# Altium schematic sheet 2_电源.schdoc
size 431 x 309 mm; Symbol: Sheet-Symbol_A3; Device: Sheet-Symbol_A3; Company: 嘉立创EDA; Version: V1.0; Page Size: A3; @Project Name: 辉光管时钟V2.0; @Page Count: 2; @Update Date: 2024-09-19; @Create Date: 2024-09-08; @Schematic Name: 电源+控制部分; @Page No: 2; @Page Name: 电源; @Board Name: 电源+控制部分; @Create Time: 15:46:08; @Update Time: 21:44:50
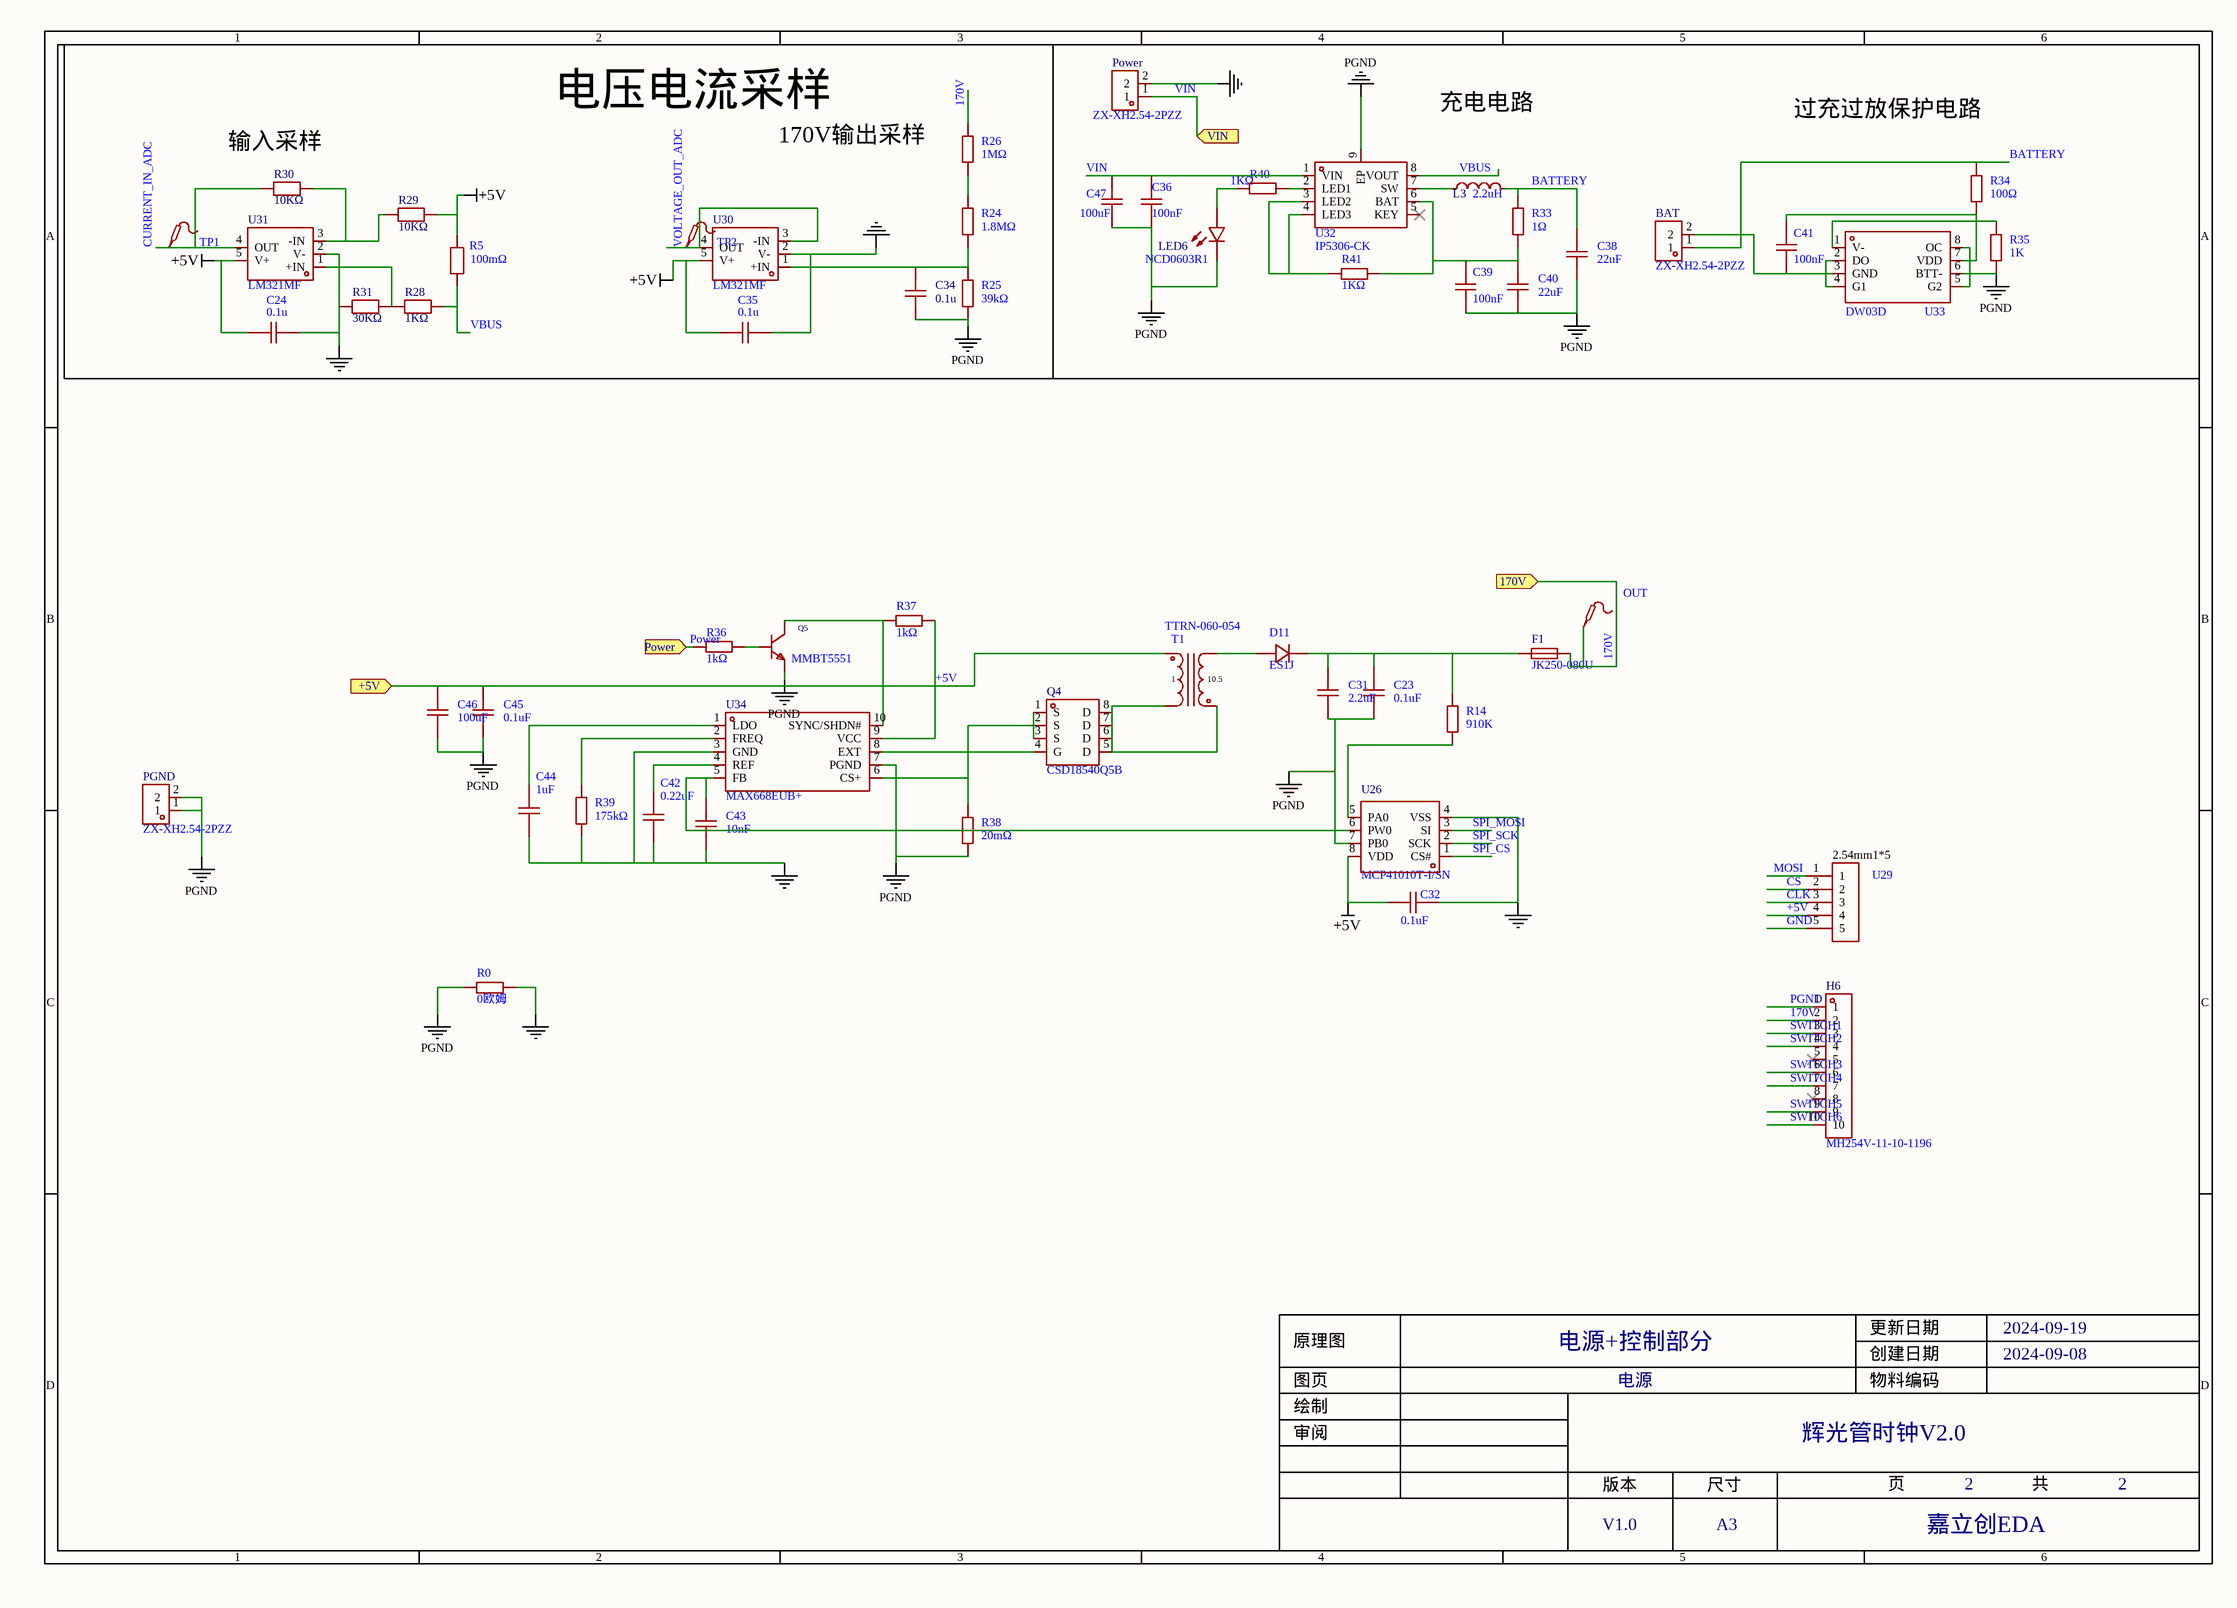
[diagram p0: 2_电源.schdoc]

## Parts
BAT  ZX-XH2.54-2PZZ  [CONN-TH_2P-P2.50_HX25003-2A]
C23  0.1uF  [c1206]
C24  0.1u  [C0603]
C31  2.2uF  [c1210]
C32  0.1uF  [c0603]
C34  0.1u  [C0603]
C35  0.1u  [C0603]
C36  100nF  [C0603]
C38  22uF  [c1206]
C39  100nF  [C0603]
C40  22uF  [c1206]
C41  100nF  [C0603]
C42  0.22uF  [c0603]
C43  10nF  [c0603]
C44  1uF  [c0603]
C45  0.1uF  [c0603]
C46  100uF  [c1206]
C47  100uF  [c1206]
D11  ES1J  [sod-123_l2.7-w1.6-ls3.6-rd]
F1  JK250-080U  [FUSE-TH_L5.8-W3.8-P5.10-D0.8]
H6  MH254V-11-10-1196  [HDR-TH_10P-P2.54-V-M]
L3  2.2uH  [IND-SMD_L7.0-W6.6]
LED6  NCD0603R1  [LED0603-RD_RED]
OUT  (no value)  [Test-Point-0.5mm]
PGND  ZX-XH2.54-2PZZ  [CONN-TH_2P-P2.50_HX25003-2A]
Power  ZX-XH2.54-2PZZ  [CONN-TH_2P-P2.50_HX25003-2A]
Q4  CSD18540Q5B  [VSON-CLIP-8_L5.0-W6.0-P1.27-BL]
Q5  MMBT5551  [SOT-23-3_L2.9-W1.3-P1.90-LS2.4-BR]
R0  0欧姆  [R0603]
R5  100mΩ  [R0805]
R14  910K  [r0603]
R24  1.8MΩ  [r0603]
R25  39kΩ  [r0603]
R26  1MΩ  [r0603]
R28  1KΩ  [R0603]
R29  10KΩ  [R0603]
R30  10KΩ  [R0603]
R31  30KΩ  [R0603]
R33  1Ω  [R0603]
R34  100Ω  [R0603]
R35  1K  [R0603]
R36  1kΩ  [r0603]
R37  1kΩ  [r0603]
R38  20mΩ  [R0805]
R39  175kΩ  [r0603]
R40  1KΩ  [R0603]
R41  1KΩ  [R0603]
T1  TTRN-060-054  [TTRN-060-054]
TP1  (no value)  [Test-Point-0.5mm]
TP2  (no value)  [Test-Point-0.5mm]
U26  MCP41010T-I/SN  [SOIC-8_L4.9-W3.9-P1.27-LS6.0-BL]
U29  (no value)  [2.54mm1*5]
U30  LM321MF  [SOT-23-5_L2.9-W1.6-P0.95-LS2.8-BL]
U31  LM321MF  [SOT-23-5_L2.9-W1.6-P0.95-LS2.8-BL]
U32  IP5306-CK  [SOP-8_L4.9-W3.9-P1.27-LS6.0-BL-EP2.1]
U33  DW03D  [TSSOP-8_L4.4-W3.0-P0.65-LS6.4-BL]
U34  MAX668EUB+  [UMAX-10_L3.0-W3.0-P0.50-LS4.9-BL]

## Blocks framed on the sheet
电压电流采样: C24 C34 C35 R5 R24-R26 R28-R31 TP1 TP2 U30 U31

## Ports
170V (in), +5V (in), Power (in), VIN (in)

## Nets
+5V: C24.2 C32.2 C35.2 C45.2 C46.2 R5.2 R29.1 R37.2 T1.1 U26.8(VDD) U29.4 U30.5(V+) U31.5(V+) U34.9(VCC) ; port +5V
GND: C24.1 C32.1 C35.1 C42.1 C43.1 C44.1 R0.2 R31.1 R39.2 U26.4(VSS) U29.5 U30.2(V-) U31.2(V-) U34.3(GND)
PGND: C23.1 C31.1 C34.2 C36.1 C38.1 C39.1 C40.1 C45.1 C46.1 C47.1 H6.1 LED6.1(K) PGND.1 PGND.2 Power.2 Q5.2(E) R0.1 R25.1 R35.1 R38.1 U26.7(PB0) U32.9(EP) U33.6(BTT-) U34.7(PGND)
170V: F1.2 H6.2 OUT.1 R26.2 ; port 170V
BATTERY: BAT.1 C38.2 L3.2 R33.2 R34.2
CLK: U29.3
CS: U29.2
CURRENT_IN_ADC: R30.2 TP1.1 U31.4(OUT)
MOSI: U29.1
Power: R36.2 ; port Power
SPI_CS: U26.1(CS#)
SPI_MOSI: U26.3(SI)
SPI_SCK: U26.2(SCK)
SWITCH1: H6.3
SWITCH2: H6.4
SWITCH3: H6.6
SWITCH4: H6.7
SWITCH5: H6.9
SWITCH6: H6.10
VBUS: R5.1 R28.1 U32.8(VOUT)
VIN: C36.2 C47.2 Power.1 U32.1(VIN) ; port VIN
VOLTAGE_OUT_ADC: TP2.1 U30.3(-IN) U30.4(OUT)
NetBAT_2: BAT.2 C41.1 U33.3(GND)
NetC23_2: C23.2 C31.2 D11.1(K) F1.1 R14.2
NetC34_1: C34.1 R24.1 R25.2 U30.1(+IN)
NetC39_2: C39.2 C40.2 R33.1 R41.1 U32.6(BAT)
NetC41_2: C41.2 R34.1 U33.7(VDD)
NetC42_2: C42.2 U34.4(REF)
NetC43_2: C43.2 U26.6(PW0) U34.5(FB)
NetC44_2: C44.2 U34.1(LDO)
NetD11_2: D11.2(A) T1.3
NetL3_1: L3.1 U32.7(SW)
NetLED6_2: LED6.2(A) R40.2
NetQ4_1: Q4.1(S) Q4.2(S) Q4.3(S) R38.2 U34.6(CS+)
NetQ4_4: Q4.4(G) U34.8(EXT)
NetQ4_5: Q4.5(D) Q4.6(D) Q4.7(D) Q4.8(D) T1.2 T1.4
NetQ5_1: Q5.1(B) R36.1
NetQ5_3: Q5.3(C) R37.1 U34.10(SYNC/SHDN#)
NetR14_1: R14.1 U26.5(PA0)
NetR24_2: R24.2 R26.1
NetR28_2: R28.2 R31.2 U31.1(+IN)
NetR29_2: R29.2 R30.1 U31.3(-IN)
NetR35_2: R35.2 U33.1(V-)
NetR39_1: R39.1 U34.2(FREQ)
NetR40_1: R40.1 U32.2(LED1)
NetR41_2: R41.2 U32.3(LED2) U32.4(LED3)
NetU33_2: U33.2(DO) U33.4(G1)
NetU33_5: U33.5(G2) U33.8(OC)

Not connected (* = marked no-connect by the designer): H6 5* 8*; U32 5(KEY)*

## Notes on the sheet
- 充电电路
- 过充过放保护电路
- (near R30) 输入采样
- 170V输出采样
- 1
- 2
- 3
- 4
- 5
- 6
- A
- B
- C
- 原理图
- 电源+控制部分
- 创建日期
- 更新日期
- 2024-09-19
- 2024-09-08
- D
- 审阅
- 绘制
- 图页
- 电源
- 物料编码
- 辉光管时钟V2.0
- 版本
- 尺寸
- 页
- 共
- V1.0
- A3
- 嘉立创EDA
- (in symbol TTRN-060-054) 10.5

## Library data of the parts
BAT PGND Power = ZX-XH2.54-2PZZ: Manufacturer: Megastar(兆星); Add into BOM: yes; Pins Structure: 1x2P; Pitch: 2.54mm; Reference Series: XH; Number of PINs Per Row: 2; Current Rating (Max): 3A; Symbol: ZX-XH2.54-2PZZ; Device: ZX-XH2.54-2PZZ; Supplier: LCSC; Supplier Part: C7429632; Manufacturer Part: ZX-XH2.54-2PZZ; JLCPCB Part Class: Extended Part; LCSC Part Name: ZX-XH2.54-2PZZ; Supplier Footprint: 插件,P=2.54mm; Datasheet: https://atta.szlcsc.com/upload/public/pdf/source/20230619/19BA6947230AA44A04D3EDD65E618FD0.pdf; Convert to PCB: yes; Mounting Style: 直插; Number of Pins: 2P; Number of Rows: 1; Row Spacing: -; Contact Material: 黄铜; Contact Plating: 锡; Operating Temperature Range: -25℃~+85℃
C23 C32 C42-C47 = CC0805KRX7R9BB104: Manufacturer: YAGEO(国巨); Symbol: capacitance; Add into BOM: yes; Tolerance: ±10%; Voltage Rated: 50V; Temperature Coefficient: X7R; Device: CC0805KRX7R9BB104; LCSC Part Name: 100nF ±10% 50V; Manufacturer Part: CC0805KRX7R9BB104; Supplier Footprint: 0805; JLCPCB Part Class: Basic Part; Datasheet: https://atta.szlcsc.com/upload/public/pdf/source/20151026/1457707504898.pdf; Supplier: LCSC; Convert to PCB: yes
  C23 C32 C45: Value: 0.1uF
  C42: Value: 0.22uF
  C43: Value: 10nF
  C44: Value: 1uF
  C46 C47: Value: 100uF
C24 C34 C35 = 0.1u: Convert to PCB: yes; Symbol: 0.1u; Device: 0.1u; Add into BOM: yes; Origin Footprint: C0603
C31 = CC0805KRX7R9BB104: Manufacturer: YAGEO(国巨); Symbol: capacitance; Add into BOM: yes; Tolerance: ±10%; Voltage Rated: 200V; Temperature Coefficient: X7R; Device: CC0805KRX7R9BB104; LCSC Part Name: 100nF ±10% 50V; Manufacturer Part: CC0805KRX7R9BB104; Supplier Footprint: 0805; JLCPCB Part Class: Basic Part; Datasheet: https://atta.szlcsc.com/upload/public/pdf/source/20151026/1457707504898.pdf; Supplier: LCSC; Convert to PCB: yes; Value: 2.2uF
C36 C39 C41 = CAP_0603: Symbol: CapAcitance; Convert to PCB: yes; Device: CAP_0603; Add into BOM: yes; Supplier Footprint: 0603; Value: 100nF
C38 C40 = CAP_1206: Symbol: CapAcitance; Convert to PCB: yes; Device: CAP_1206; Add into BOM: yes; Supplier Footprint: 1206; Value: 22uF
D11 = ES1J_C691230: Manufacturer: DIODES(美台); Symbol: 1n4007_c9900004759; Add into BOM: yes; Device: ES1J_C691230; LCSC Part Name: ES1J; Supplier Part: C691230; Manufacturer Part: ES1J; Supplier Footprint: SMA; JLCPCB Part Class: Extended Part; Datasheet: https://atta.szlcsc.com/upload/public/pdf/source/20200628/C691230_6EC9ACEA5CE84292BBF501D48DE20532.pdf; Supplier: LCSC; Convert to PCB: yes
F1 = JK250-080U: Manufacturer: JK(金科); Symbol: JK250-080U_C369127; Add into BOM: yes; Operating Voltage (Max): 250V; Current Rating (Max): 3A; Hold Current: 80mA; Trip Current: 160mA; Maximum Time to Trip: 500ms; Device: JK250-080U; LCSC Part Name: 250V 80mA 插件自恢复; Supplier Part: C369127; Manufacturer Part: JK250-080U; Supplier Footprint: 插件; JLCPCB Part Class: Extended Part; Datasheet: https://atta.szlcsc.com/upload/public/pdf/source/20190402/C369127_E7230E1328F96C53474DAC88A9C5A944.pdf; Supplier: LCSC; Convert to PCB: yes
H6 = MH254V-11-10-1196: Manufacturer: XFCN(兴飞); Add into BOM: yes; Symbol: MH254V-11-10-1196; Device: MH254V-11-10-1196; LCSC Part Name: 圆孔排针2.54mm 1x10P 直插 镀金1U L=11.96mm 常规型; Supplier Part: C5184055; Manufacturer Part: MH254V-11-10-1196; Supplier Footprint: 插件,P=2.54mm; JLCPCB Part Class: 扩展库; Datasheet: https://atta.szlcsc.com/upload/public/pdf/source/20220929/9F034EF7D5273C93A87A714F13A4BC8E.pdf; Supplier: LCSC; Convert to PCB: yes
L3 = APH0630T1R0M: Manufacturer: APV(爱普微); Symbol: SDFL1608S100KTF; Add into BOM: yes; Type: 一体成型电感; Tolerance: ±20%; Rated Current: 10.73A; Saturation Current (Isat): 12.45A; DC Resistance (DCR): 7.4mΩ; Device: APH0630T1R0M; Supplier: LCSC; Manufacturer Part: APH0630T1R0M; Value: 2.2uH; JLCPCB Part Class: Extended Part; LCSC Part Name: 1uH ±20% 12.45A; Supplier Footprint: L0630; Datasheet: https://atta.szlcsc.com/upload/public/pdf/source/20230920/8DF4F91CA8787177DE496A10F73889DA.pdf; Convert to PCB: yes; Ratings: -
LED6 = NCD0603R1_C84263: Manufacturer: 国星光电; Symbol: FC-DA1608HRK-620D; Add into BOM: yes; Emitted Color: 红色; Forward Voltage (VF): 1.6V~2.6V; Forward Current: 20mA; Power Dissipation: 65mW; Lens Color: 无色透明; Dominant Wavelength: 615nm~630nm; Luminous Intensity: 80mcd~220mcd; Viewing Angle: 130°; Device: NCD0603R1_C84263; Supplier: LCSC; Manufacturer Part: NCD0603R1; Supplier Part: C84263; JLCPCB Part Class: 扩展库; LCSC Part Name: 红灯 0603红灯   正贴; Supplier Footprint: 0603; Datasheet: https://atta.szlcsc.com/upload/public/pdf/source/20200820/C84263_DABC6A75E58F576973B407FDBA283D60.pdf; Convert to PCB: yes; Operating Temperature: -30℃~+85℃
OUT TP1 TP2 = Test-Point: Add into BOM: yes; Symbol: Test-Point; Device: Test-Point; Convert to PCB: yes
Q4 = CSD18540Q5B: Manufacturer: TI(德州仪器); Add into BOM: yes; Type: 1个N沟道; Drain Source Voltage (Vdss): 60V; Continuous Drain Current (Id): 100A; Power Dissipation (Pd): 3.1W；195W; Drain Source On Resistance (RDS(on)@Vgs,Id): 2.2mΩ@10V,28A; Gate Threshold Voltage (Vgs(th)@Id): 2.3V@250uA; Total Gate Charge (Qg@Vgs): 53nC@10V; Input Capacitance (Ciss@Vds): 4.23nF@30V; Symbol: CSD18540Q5B; Device: CSD18540Q5B; LCSC Part Name: 1个N沟道 耐压:60V 电流:100A; Supplier Part: C86513; Manufacturer Part: CSD18540Q5B; Supplier Footprint: VSON-8(5x6); JLCPCB Part Class: 扩展库; Datasheet: https://www.ti.com/cn/lit/gpn/csd18540q5b; Supplier: LCSC; Convert to PCB: yes; Operating Temperature: -55℃~+150℃@(Tj)
Q5 = MMBT5551_C2145: Manufacturer: CJ(江苏长电/长晶); Symbol: bcx70ke6327htsa1; Add into BOM: yes; Transistor Type: NPN; Collector-Emitter Breakdown Voltage (Vceo): 160V; Collector Current (Ic): 600mA; Power Dissipation (Pd): 300mW; Collector Cut-Off Current (Icbo): 50nA; Collector-Emitter Saturation Voltage (VCE(sat)@Ic,Ib): 200mV@50mA,5mA; DC Current Gain (hFE@Ic,Vce): 200@10mA,5V; Transition Frequency (fT): 100MHz; Device: MMBT5551_C2145; Supplier: LCSC; Supplier Part: C2145; Manufacturer Part: MMBT5551; LCSC Part Name: NPN 160V 600mA G1 H档200-300; Supplier Footprint: SOT-23; JLCPCB Part Class: Basic Part; Datasheet: https://atta.szlcsc.com/upload/public/pdf/source/20140809/1457707209203.pdf; Convert to PCB: yes; Operating Temperature: +150℃@(Tj)
R0 = Res_0603: Symbol: 电阻; Convert to PCB: yes; Device: Res_0603; Add into BOM: yes; Supplier Footprint: 0603; Value: 0欧姆
R5 R28-R31 = 5mΩ: Convert to PCB: yes; Origin Footprint: R1206; Symbol: 5mΩ; Device: 5mΩ; Add into BOM: yes
R14 R24-R26 R36 R37 R39 = 0805W8F1002T5E_C17414: Manufacturer: UNI-ROYAL(厚声); Symbol: 电阻; Add into BOM: yes; Tolerance: ±1%; Power(Watts): 125mW; Temperature Coefficient: ±100ppm/℃; Overload Voltage (Max): 150V; Device: 0805W8F1002T5E_C17414; LCSC Part Name: 10kΩ ±1% 125mW; Manufacturer Part: 0805W8F1002T5E; Supplier Footprint: 0805; JLCPCB Part Class: Basic Part; Datasheet: https://atta.szlcsc.com/upload/public/pdf/source/20200306/C422600_1E6D84923E4A46A82E41ADD87F860B5C.pdf; Supplier: LCSC; Convert to PCB: yes; Type: 厚膜电阻; Operating Temperature Range: -55℃~+155℃
  R14: Value: 910K
  R24: Value: 1.8MΩ
  R25: Value: 39kΩ
  R26: Value: 1MΩ
  R36 R37: Value: 1kΩ
  R39: Value: 175kΩ
R33-R35 R40 R41 = Res_0805: Symbol: 电阻; Convert to PCB: yes; Device: Res_0805; Add into BOM: yes; Supplier Footprint: 0805
  R33: Value: 1Ω
  R34: Value: 100Ω
  R35: Value: 1K
  R40 R41: Value: 1KΩ
R38 = RL10FTNR160: Manufacturer: 大毅科技; Symbol: 电阻; Add into BOM: yes; Tolerance: ±1%; Power(Watts): 125mW; Temperature Coefficient: ±100ppm/℃; Overload Voltage (Max): 150V; Device: RL10FTNR160; LCSC Part Name: 160mΩ ±1%; Manufacturer Part: RL10FTNR160; Supplier Footprint: 0805; JLCPCB Part Class: Extended Part; Datasheet: https://atta.szlcsc.com/upload/public/pdf/source/20220824/9B3755BD17A966410CFA156DB04E8A1C.pdf; Supplier: LCSC; Convert to PCB: yes; Value: 20mΩ; Type: 厚膜电阻; Operating Temperature Range: -55℃~+155℃
T1 = TTRN-060-054: Add into BOM: yes; _: 3; Symbol: TTRN-060-054; Device: TTRN-060-054; Convert to PCB: yes; Supplier: TOKOT COIL
U26 = MCP41010T-I/SN: Manufacturer: MICROCHIP(美国微芯); Add into BOM: yes; Supply Voltage: 2.7V~5.5V; Resistance Value (Ohms): 10kΩ; Number of Taps: 256; Temperature Coefficient (Typ): 800ppm/℃; Precision: ±20%; Number of Channels: 1; Interface Type: SPI; Symbol: MCP41010T-I/SN; Device: MCP41010T-I/SN; Supplier: LCSC; Manufacturer Part: MCP41010T-I/SN; Supplier Part: C136395; JLCPCB Part Class: Extended Part; Value: -; LCSC Part Name: MCP41010T-I/SN; Supplier Footprint: SOP-8; Datasheet: https://atta.szlcsc.com/upload/public/pdf/source/20220205/C2666606_C5E8E7A5F3891B321C1555D845654E7B.pdf; Convert to PCB: yes; Operating Temperature: -40℃~+85℃
U29 = 2.54mm1*5: Add into BOM: yes; Symbol: 2.54mm1*5; Device: 2.54mm1*5; Convert to PCB: yes
U30 U31 = LM321MF: Manufacturer: UMW(友台半导体); Add into BOM: yes; Symbol: LM321MF; Device: LM321MF; LCSC Part Name: LM321MF; Supplier Part: C668208; Manufacturer Part: LM321MF; Supplier Footprint: SOT-23-5L; JLCPCB Part Class: 扩展库; Datasheet: https://atta.szlcsc.com/upload/public/pdf/source/20231109/E49D74FC1833823153F9A4939CD7E005.pdf; Supplier: LCSC; Convert to PCB: yes; Number of Circuits: -
U32 = IP5306-CK: Add into BOM: yes; Symbol: IP5306-CK; Device: IP5306-CK; LCSC Part Name: IP5306-CK; Supplier Part: C2914335; Manufacturer Part: IP5306-CK; Supplier Footprint: ESOP-8_L4.9-W3.9-P1.27-LS6.0-B; JLCPCB Part Class: Extended Part; Supplier: LCSC; Convert to PCB: yes
U33 = DW03D: Manufacturer: FM(富满); Add into BOM: yes; Symbol: DW03D; Device: DW03D; LCSC Part Name: DW03D; Supplier Part: C82200; Manufacturer Part: DW03D; Supplier Footprint: TSSOP-8(3x4.4x0.65); JLCPCB Part Class: Extended Part; Datasheet: https://atta.szlcsc.com/upload/public/pdf/source/20170814/C82200_1502678439162886029.pdf; Supplier: LCSC; Convert to PCB: yes
U34 = MAX668EUB+: Manufacturer: ADI(亚德诺)/MAXIM(美信); Symbol: MAX668EUB+_C1530054; Add into BOM: yes; Supply Voltage: 3V~28V; Switching Frequency: 100kHz~500kHz; Duty Cycle: 90%; Topology: 反激式；SEPIC；升压式; Device: MAX668EUB+; LCSC Part Name: MAX668EUB+; Supplier Part: C1530054; Manufacturer Part: MAX668EUB+; Supplier Footprint: MSOP-10; JLCPCB Part Class: 扩展库; Datasheet: https://atta.szlcsc.com/upload/public/pdf/source/20171204/C143564_15123772685461162718.pdf; Supplier: LCSC; Convert to PCB: yes; Operating Temperature: -40℃~+85℃@(TA)